# EAGLE design Laser_Teensy_proto_edits_11-21 (EAGLE 9.6.2)

## Sheet 1 of 3
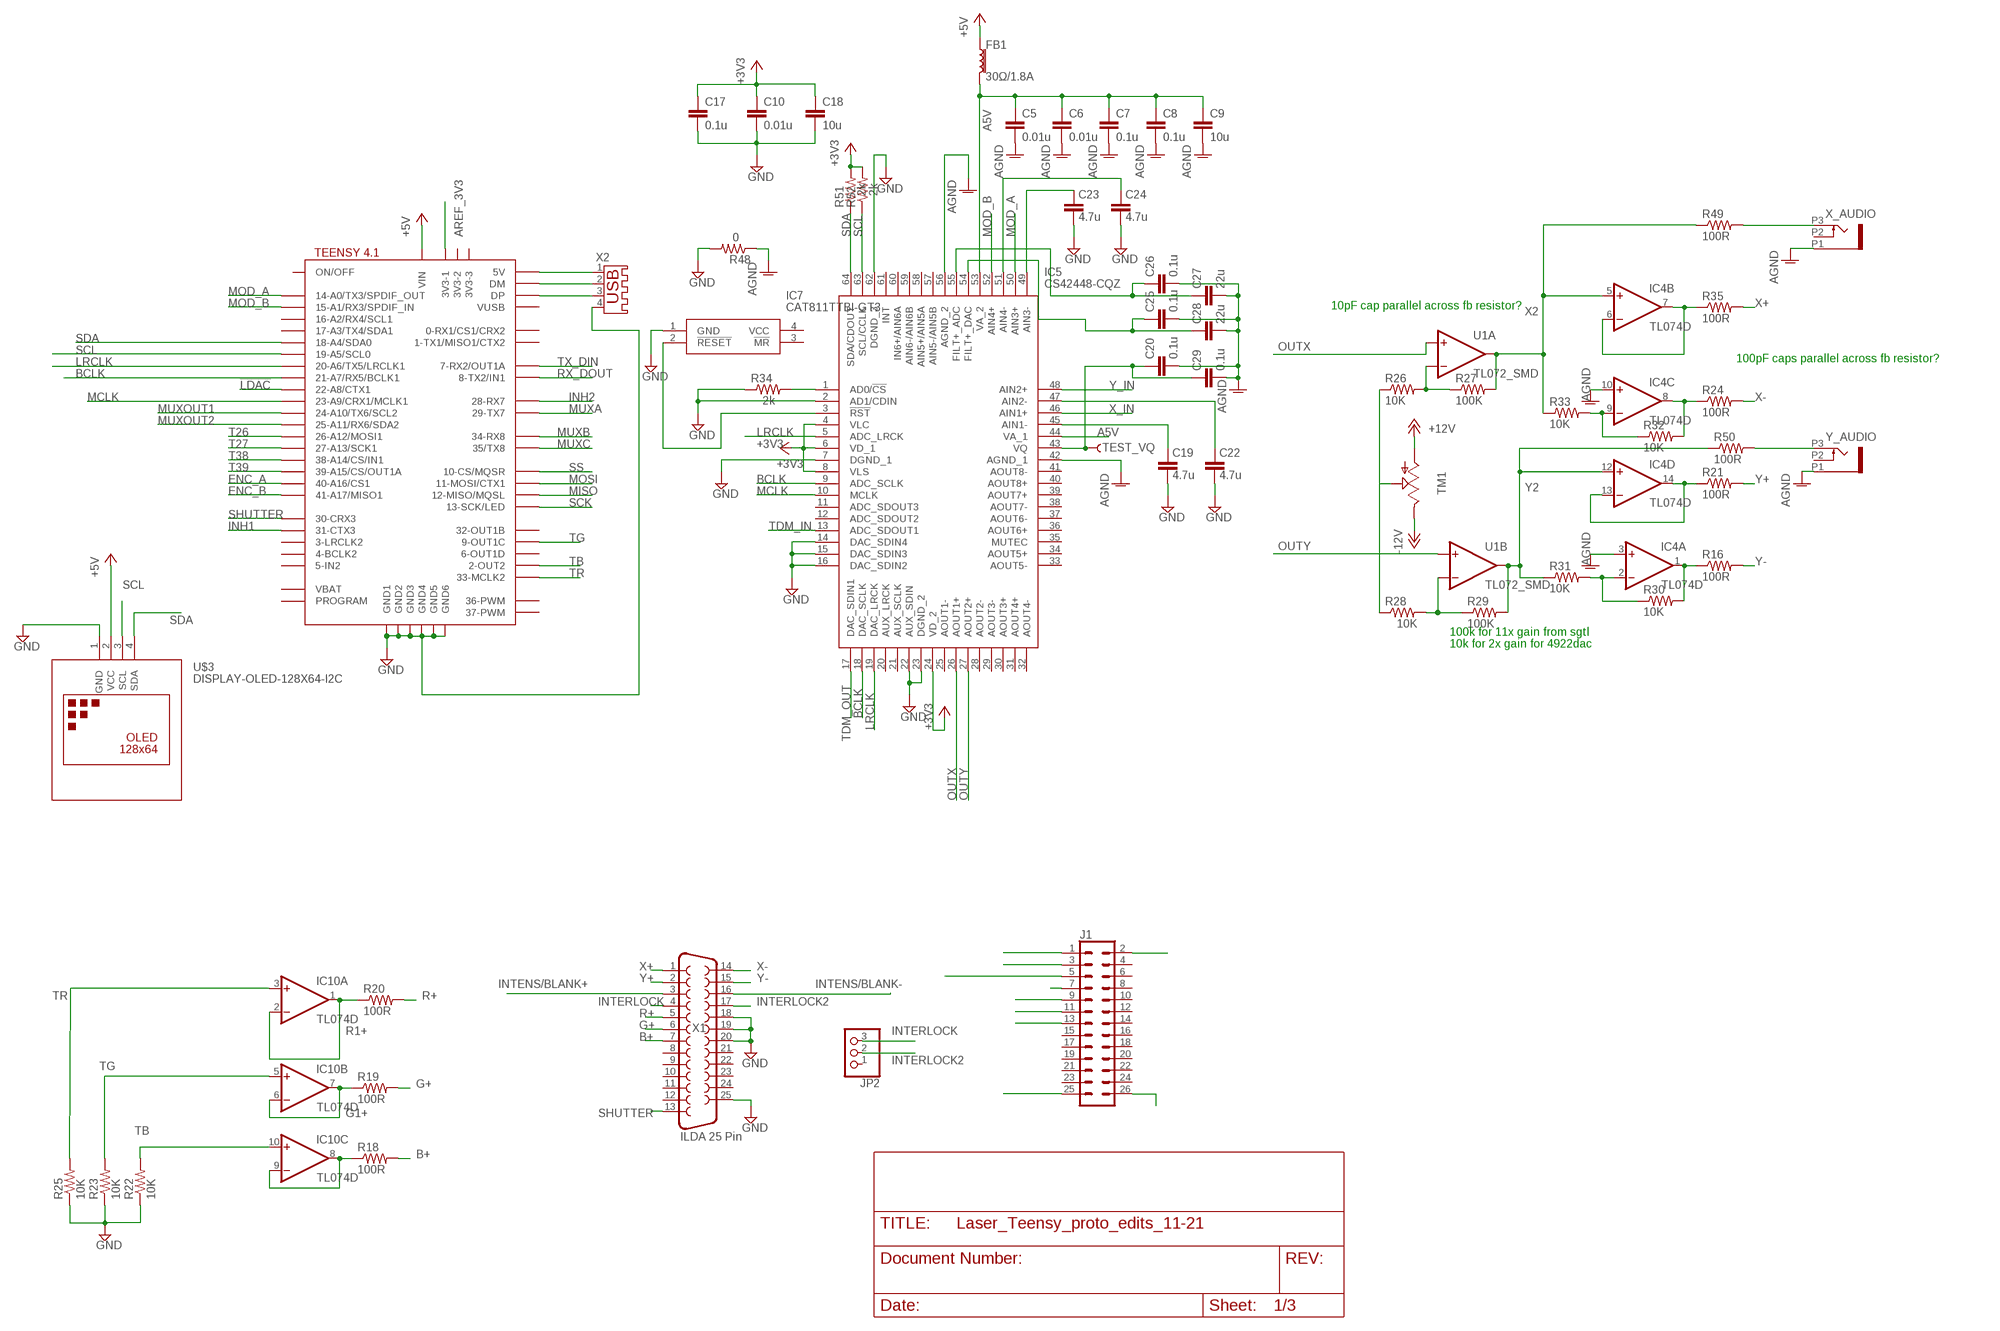
[diagram p0: schematic, sheet 1]

### Parts
C5  0.01u  C-EUC0603  [C0603]
C6  0.01u  C-EUC0603  [C0603]
C7  0.1u  C-EUC0603  [C0603]
C8  0.1u  C-EUC0603  [C0603]
C9  10u  C-EUC0603  [C0603]
C10  0.01u  C-EUC0603  [C0603]
C17  0.1u  C-EUC0603  [C0603]
C18  10u  C-EUC0603  [C0603]
C19  4.7u  C-EUC0603  [C0603]
C20  0.1u  C-EUC0603  [C0603]
C22  4.7u  C-EUC0603  [C0603]
C23  4.7u  C-EUC0603  [C0603]
C24  4.7u  C-EUC0603  [C0603]
C25  0.1u  C-EUC0603  [C0603]
C26  0.1u  C-EUC0603  [C0603]
C27  22u  C-EUC0603  [C0603]
C28  22u  C-EUC0603  [C0603]
C29  0.1u  C-EUC0603  [C0603]
FB1  30Ω/1.8A  FERRITE_BEAD-0603  [0603]
IC4  TL074D  [SO14]
IC5  CS42448-CQZ  [QFP50P1200X1200X160-64N]
IC7  CAT811TTBI-GT3  [4-PIN-SOT-143(BI-SUFFIX-CASE-5]
IC10  TL074D  [SO14]
J1  CONN_13X22X13  [2X13]
JP2  PINHD-1X3  [1X03]
R16  100R  R-US_R0603  [R0603]
R18  100R  R-US_R0603  [R0603]
R19  100R  R-US_R0603  [R0603]
R20  100R  R-US_R0603  [R0603]
R21  100R  R-US_R0603  [R0603]
R22  10K  R-US_R0603  [R0603]
R23  10K  R-US_R0603  [R0603]
R24  100R  R-US_R0603  [R0603]
R25  10K  R-US_R0603  [R0603]
R26  10K  R-US_R0603  [R0603]
R27  100K  R-US_R0603  [R0603]
R28  10K  R-US_R0603  [R0603]
R29  100K  R-US_R0603  [R0603]
R30  10K  R-US_R0603  [R0603]
R31  10K  R-US_R0603  [R0603]
R32  10K  R-US_R0603  [R0603]
R33  10K  R-US_R0603  [R0603]
R34  2k  R-US_R0603  [R0603]
R35  100R  R-US_R0603  [R0603]
R48  0  R-US_R0603  [R0603]
R49  100R  R-US_R0603  [R0603]
R50  100R  R-US_R0603  [R0603]
R51  2k  R-US_R0603  [R0603]
R52  2k  R-US_R0603  [R0603]
TEST_VQ  TEST-VQ  TEST-POINT3  [PAD.03X.03]
TM1  TRIM  [6MM]
U1  TL072_SMD  [SO08]
U$2  TEENSY41-E  [TENNSY41-E]
U$3  DISPLAY-OLED-128X64-I2C  [DISPLAY-OLED-128X64-I2C]
X1  ILDA 25 Pin  F25D  [F25D]
X2  USB-A003  [USB-A003]
X_AUDIO  PJ301_THONKICONN6  [WQP_PJ_301M6]
Y_AUDIO  PJ301_THONKICONN6  [WQP_PJ_301M6]

### Nets
!LDAC: U$2.22-A8/CTX1
+3V3: C10.1 C17.1 C18.1 IC5.4(VLC) IC5.6(VD_1) IC5.8(VLS) IC5.24(VD_2) R51.2 R52.2 ; also sheet 2,3
+5V [power]: FB1.1 U$2.VIN U$3.2(VCC) ; also sheet 2,3
+12V [power]: TM1.A ; also sheet 3
-12V [power]: TM1.E ; also sheet 3
A5V: C5.1 C6.1 C7.1 C8.1 C9.1 FB1.2 IC5.44(VA_1) IC5.53(VA_2)
AGND: C5.2 C6.2 C7.2 C8.2 C9.2 C20.2 C25.2 C26.2 C27.2 C28.2 C29.2 IC4.3(A:+IN) IC4.10(C:+IN) IC5.42(AGND_1) IC5.56(AGND_2) R48.1 X_AUDIO.P1 Y_AUDIO.P1 ; also sheet 2,3
AREF_3V3: U$2.3V3-1
B1+1: IC10.8(C:OUT) IC10.9(C:-IN) R18.1
B+: R18.2 X1.7
BCLK: IC5.9(ADC_SCLK) IC5.18(DAC_SCLK) U$2.21-A7/RX5/BCLK1
ENC_A: U$2.40-A16/CS1 ; also sheet 2
ENC_B: U$2.41-A17/MISO1 ; also sheet 2
G1+: IC10.6(B:-IN) IC10.7(B:OUT) R19.1
G+: R19.2 X1.6
GND: C10.2 C17.2 C18.2 C19.2 C22.2 C23.2 C24.2 IC5.2(AD1/CDIN) IC5.7(DGND_1) IC5.14(DAC_SDIN4) IC5.15(DAC_SDIN3) IC5.16(DAC_SDIN2) IC5.22(AUX_SDIN) IC5.23(DGND_2) IC5.62(DGND_3) IC7.1(GND) R22.1 R23.1 R25.1 R34.1 R48.2 U$2.GND1 U$2.GND2 U$2.GND3 U$2.GND4 U$2.GND5 U$2.GND6 U$3.1(GND) X1.18 X1.19 X1.20 X1.25 X2.4 ; also sheet 2,3
INH1: U$2.31-CTX3 ; also sheet 2
INH2: U$2.28-RX7 ; also sheet 2
INTENS/BLANK+: X1.3
INTENS/BLANK-: X1.16
INTERLOCK: JP2.3 X1.4
INTERLOCK2: JP2.2 X1.17
LRCLK: IC5.5(ADC_LRCK) IC5.19(DAC_LRCK) U$2.20-A6/TX5/LRCLK1
MCLK: IC5.10(MCLK) U$2.23-A9/CRX1/MCLK1
MISO: U$2.12-MISO/MQSL
MOD_A: IC5.50(AIN3+) U$2.14-A0/TX3/SPDIF_OUT ; also sheet 2
MOD_B: IC5.52(AIN4+) U$2.15-A1/RX3/SPDIF_IN ; also sheet 2
MOSI: U$2.11-MOSI/CTX1
MUXA: U$2.29-TX7 ; also sheet 2
MUXB: U$2.34-RX8 ; also sheet 2
MUXC: U$2.35-TX8(35/TX8) ; also sheet 2
MUXOUT1: U$2.24-A10/TX6/SCL2 ; also sheet 2
MUXOUT2: U$2.25-A11/RX6/SDA2 ; also sheet 2
N$1: IC5.3(!RST) IC7.2(!RESET)
N$2: R26.1 R28.1 TM1.S
N$3: U$2.+5V(5V) X2.1
N$4: U$2.DM X2.2
N$5: U$2.DP X2.3
N$12: J1.1
N$13: R49.2 X_AUDIO.P3
N$17: C23.1 IC5.49(AIN3-)
N$18: R50.2 Y_AUDIO.P3
N$30: R26.2 R27.1 U1.2(A:-IN)
N$31: R28.2 R29.1 U1.6(B:-IN)
N$35: IC4.9(C:-IN) R32.1 R33.2
N$36: IC4.2(A:-IN) R30.1 R31.2
N$37: C24.1 IC5.51(AIN4-)
N$38: C19.1 IC5.45(AIN1-)
N$47: C22.1 IC5.47(AIN2-)
N$50: IC5.1(AD0/!CS) R34.2
N$53: J1.3
N$54: J1.5
N$55: J1.7
N$56: J1.9
N$57: J1.11
N$58: J1.13
N$59: J1.25
N$60: J1.26
N$61: C26.1 C27.1 IC5.55(FILT+_ADC)
N$62: C25.1 C28.1 IC5.54(FILT+_DAC)
N$63: C20.1 C29.1 IC5.43(VQ) TEST_VQ.P$1
N$64: J1.2
OUTX: IC5.26(AOUT1+) U1.3(A:+IN)
OUTY: IC5.27(AOUT2+) U1.5(B:+IN)
R1+: IC10.1(A:OUT) IC10.2(A:-IN) R20.1
R+: R20.2 X1.5
RX_DOUT: U$2.8-TX2/IN1
SCK: U$2.13-SCK/LED
SCL: IC5.63(SCL/CCLK) R52.1 U$2.19-A5/SCL0 U$3.3(SCL)
SDA: IC5.64(SDA/CDOUT) R51.1 U$2.18-A4/SDA0 U$3.4(SDA)
SHUTTER: U$2.30-CRX3 X1.13
SS: U$2.10-CS\MQSR(10-CS/MQSR)
T26: U$2.26-A12/MOSI1 ; also sheet 2
T27: U$2.27-A13/SCK1 ; also sheet 2
T38: U$2.38-A14/CS/IN1 ; also sheet 2
T39: U$2.39-A15/CS/OUT1A
TB: IC10.10(C:+IN) R22.2 U$2.2-OUT2
TDM_IN: IC5.13(ADC_SDOUT1)
TDM_OUT: IC5.17(DAC_SDIN1)
TG: IC10.5(B:+IN) R23.2 U$2.9-OUT1C
TR: IC10.3(A:+IN) R25.2 U$2.33-MCLK2
TX_DIN: U$2.7-RX2/OUT1A
X1+: IC4.6(B:-IN) IC4.7(B:OUT) R35.1
X1-: IC4.8(C:OUT) R24.1 R32.2
X2: IC4.5(B:+IN) R27.2 R33.1 R49.1 U1.1(A:OUT)
X+: R35.2 X1.1
X-: R24.2 X1.14
X_IN: IC5.46(AIN1+) ; also sheet 2
Y1+: IC4.13(D:-IN) IC4.14(D:OUT) R21.1
Y1-: IC4.1(A:OUT) R16.1 R30.2
Y2: IC4.12(D:+IN) R29.2 R31.1 R50.1 U1.7(B:OUT)
Y+: R21.2 X1.2
Y-: R16.2 X1.15
Y_IN: IC5.48(AIN2+) ; also sheet 2
Unconnected: IC5.11(ADC_SDOUT3) IC5.12(ADC_SDOUT2) IC5.20(AUX_LRCK) IC5.21(AUX_SCLK) IC5.25(AOUT1-) IC5.28(AOUT2-) IC5.29(AOUT3-) IC5.30(AOUT3+) IC5.31(AOUT4+) IC5.32(AOUT4-) IC5.33(AOUT5-) IC5.34(AOUT5+) IC5.35(MUTEC) IC5.36(AOUT6+) IC5.37(AOUT6-) IC5.38(AOUT7-) IC5.39(AOUT7+) IC5.40(AOUT8+) IC5.41(AOUT8-) IC5.57(AIN5-/AIN5B) IC5.58(AIN5+/AIN5A) IC5.59(AIN6-/AIN6B) IC5.60(IN6+/AIN6A) IC5.61(INT) IC7.3(!MR) J1.4 J1.6 J1.8 J1.10 J1.12 J1.14 J1.15 J1.16 J1.17 J1.18 J1.19 J1.20 J1.21 J1.22 J1.23 J1.24 JP2.1 U$2.0-RX1/CS1/CRX2 U$2.1-TX1/MISO1/CTX2 U$2.3-LRCLK2 U$2.3V3-2 U$2.3V3-3 U$2.4-BCLK2 U$2.5-IN2 U$2.6-OUT1D U$2.16-A2/RX4/SCL1 U$2.17-A3/TX4/SDA1 U$2.32-OUT1B U$2.36-PWM U$2.37-PWM U$2.ON/OFF U$2.PROGRAM U$2.VBAT U$2.VUSB X1.8 X1.9 X1.10 X1.11 X1.12 X1.21 X1.22 X1.23 X1.24 X_AUDIO.P2 Y_AUDIO.P2

### Notes on the sheet
- 10pF cap parallel across fb resistor?
- 100pF caps parallel across fb resistor?
- 100k for 11x gain from sgtl
- 10k for 2x gain for 4922dac

## Sheet 2 of 3
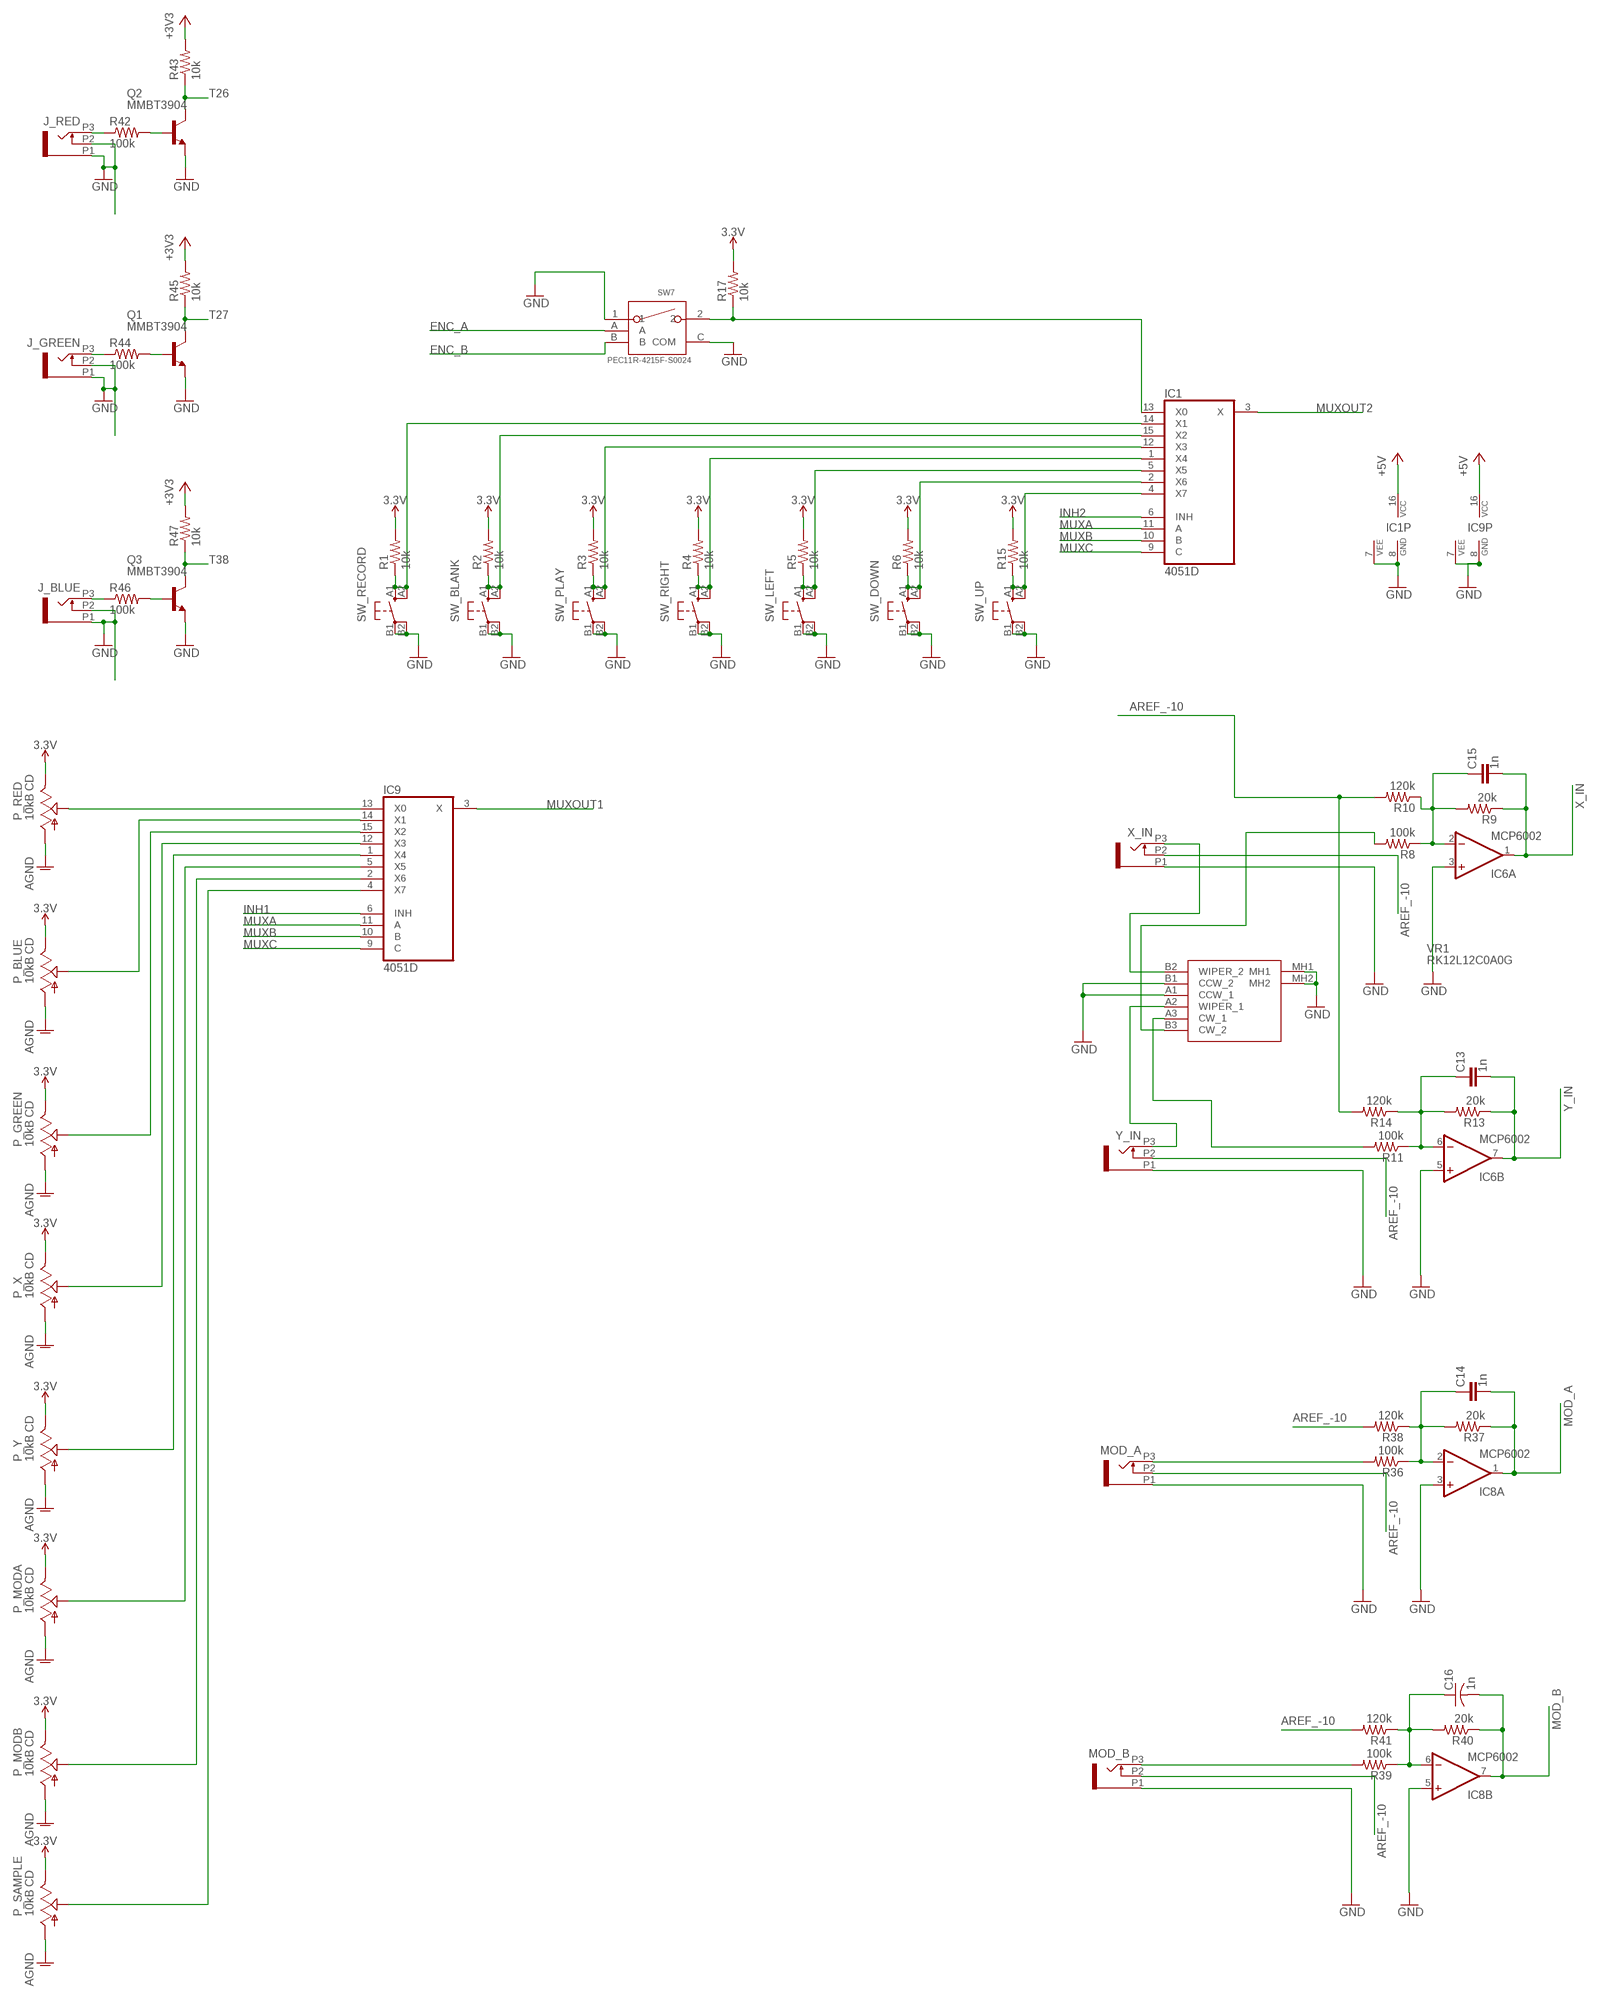
[diagram p1: schematic, sheet 2]

### Parts
C13  1n  C-EUC0603  [C0603]
C14  1n  C-EUC0603  [C0603]
C15  1n  C-EUC0603  [C0603]
C16  1n  C-USC0603K  [C0603K]
IC1  4051D  [SO16]
IC6  MCP6002  TL072D  [SO08]
IC8  MCP6002  TL072D  [SO08]
IC9  4051D  [SO16]
J_BLUE  PJ301_THONKICONN6  [WQP_PJ_301M6]
J_GREEN  PJ301_THONKICONN6  [WQP_PJ_301M6]
J_RED  PJ301_THONKICONN6  [WQP_PJ_301M6]
MOD_A  PJ301_THONKICONN6  [WQP_PJ_301M6]
MOD_B  PJ301_THONKICONN6  [WQP_PJ_301M6]
P_BLUE  10kB CD  POT_USVERTICAL_PS  [ALPS_POT_VERTICAL_PS]
P_GREEN  10kB CD  POT_USVERTICAL_PS  [ALPS_POT_VERTICAL_PS]
P_MODA  10kB CD  POT_USVERTICAL_PS  [ALPS_POT_VERTICAL_PS]
P_MODB  10kB CD  POT_USVERTICAL_PS  [ALPS_POT_VERTICAL_PS]
P_RED  10kB CD  POT_USVERTICAL_PS  [ALPS_POT_VERTICAL_PS]
P_SAMPLE  10kB CD  POT_USVERTICAL_PS  [ALPS_POT_VERTICAL_PS]
P_X  10kB CD  POT_USVERTICAL_PS  [ALPS_POT_VERTICAL_PS]
P_Y  10kB CD  POT_USVERTICAL_PS  [ALPS_POT_VERTICAL_PS]
Q1  MMBT3904  MMBT3904LT1-NPN-SOT23-BEC  [SOT23-BEC]
Q2  MMBT3904  MMBT3904LT1-NPN-SOT23-BEC  [SOT23-BEC]
Q3  MMBT3904  MMBT3904LT1-NPN-SOT23-BEC  [SOT23-BEC]
R1  10k  R-US_R0603  [R0603]
R2  10k  R-US_R0603  [R0603]
R3  10k  R-US_R0603  [R0603]
R4  10k  R-US_R0603  [R0603]
R5  10k  R-US_R0603  [R0603]
R6  10k  R-US_R0603  [R0603]
R8  100k  R-US_R0603  [R0603]
R9  20k  R-US_R0603  [R0603]
R10  120k  R-US_R0603  [R0603]
R11  100k  R-US_R0603  [R0603]
R13  20k  R-US_R0603  [R0603]
R14  120k  R-US_R0603  [R0603]
R15  10k  R-US_R0603  [R0603]
R17  10k  R-US_R0603  [R0603]
R36  100k  R-US_R0603  [R0603]
R37  20k  R-US_R0603  [R0603]
R38  120k  R-US_R0603  [R0603]
R39  100k  R-US_R0603  [R0603]
R40  20k  R-US_R0603  [R0603]
R41  120k  R-US_R0603  [R0603]
R42  100k  R-US_R0603  [R0603]
R43  10k  R-US_R0603  [R0603]
R44  100k  R-US_R0603  [R0603]
R45  10k  R-US_R0603  [R0603]
R46  100k  R-US_R0603  [R0603]
R47  10k  R-US_R0603  [R0603]
SW7  PEC11R-4215F-S0024  [PEC11R-4215F-S0024]
SW_BLANK  D6R  [D6R]
SW_DOWN  D6R  [D6R]
SW_LEFT  D6R  [D6R]
SW_PLAY  D6R  [D6R]
SW_RECORD  D6R  [D6R]
SW_RIGHT  D6R  [D6R]
SW_UP  D6R  [D6R]
VR1  RK12L12C0A0G  [RK12L12C0A0G]
X_IN  PJ301_THONKICONN6  [WQP_PJ_301M6]
Y_IN  PJ301_THONKICONN6  [WQP_PJ_301M6]

### Nets
3.3V [+3V3]: P_BLUE.P$1(E) P_GREEN.P$1(E) P_MODA.P$1(E) P_MODB.P$1(E) P_RED.P$1(E) P_SAMPLE.P$1(E) P_X.P$1(E) P_Y.P$1(E) R1.2 R2.2 R3.2 R4.2 R5.2 R6.2 R15.2 R17.2
+3V3: R43.2 R45.2 R47.2 ; also sheet 1,3
+5V [power]: IC1.16(VCC) IC9.16(VCC) ; also sheet 1,3
AGND: P_BLUE.P$3(A) P_GREEN.P$3(A) P_MODA.P$3(A) P_MODB.P$3(A) P_RED.P$3(A) P_SAMPLE.P$3(A) P_X.P$3(A) P_Y.P$3(A) ; also sheet 1,3
AREF_-10 [-10V]: MOD_A.P2 MOD_B.P2 R10.2 R14.2 R38.2 R41.2 X_IN.P2 Y_IN.P2 ; also sheet 3
ENC_A: SW7.A ; also sheet 1
ENC_B: SW7.B ; also sheet 1
GND: IC1.7(VEE) IC1.8(GND) IC6.3(A:+IN) IC6.5(B:+IN) IC8.3(A:+IN) IC8.5(B:+IN) IC9.7(VEE) IC9.8(GND) J_BLUE.P1 J_BLUE.P2 J_GREEN.P1 J_GREEN.P2 J_RED.P1 J_RED.P2 MOD_A.P1 MOD_B.P1 Q1.E Q2.E Q3.E SW7.1 SW7.C(COM) SW_BLANK.B1(P) SW_BLANK.B2(P1) SW_DOWN.B1(P) SW_DOWN.B2(P1) SW_LEFT.B1(P) SW_LEFT.B2(P1) SW_PLAY.B1(P) SW_PLAY.B2(P1) SW_RECORD.B1(P) SW_RECORD.B2(P1) SW_RIGHT.B1(P) SW_RIGHT.B2(P1) SW_UP.B1(P) SW_UP.B2(P1) VR1.A1(CCW_1) VR1.B1(CCW_2) VR1.MH1 VR1.MH2 X_IN.P1 Y_IN.P1 ; also sheet 1,3
INH1: IC9.6(INH) ; also sheet 1
INH2: IC1.6(INH) ; also sheet 1
MOD_A: C14.2 IC8.1(A:OUT) R37.1 ; also sheet 1
MOD_B: C16.2 IC8.7(B:OUT) R40.1 ; also sheet 1
MUXA: IC1.11(A) IC9.11(A) ; also sheet 1
MUXB: IC1.10(B) IC9.10(B) ; also sheet 1
MUXC: IC1.9(C) IC9.9(C) ; also sheet 1
MUXOUT1: IC9.3(X) ; also sheet 1
MUXOUT2: IC1.3(X) ; also sheet 1
N$6: C15.1 IC6.2(A:-IN) R8.1 R9.2 R10.1
N$9: VR1.B2(WIPER_2) X_IN.P3
N$11: C13.1 IC6.6(B:-IN) R11.1 R13.2 R14.1
N$14: C14.1 IC8.2(A:-IN) R36.1 R37.2 R38.1
N$15: R8.2 VR1.B3(CW_2)
N$19: IC1.14(X1) R1.1 SW_RECORD.A1(S) SW_RECORD.A2(S1)
N$20: IC1.15(X2) R2.1 SW_BLANK.A1(S) SW_BLANK.A2(S1)
N$21: IC1.12(X3) R3.1 SW_PLAY.A1(S) SW_PLAY.A2(S1)
N$22: IC9.13(X0) P_RED.P$2(S)
N$23: IC1.1(X4) R4.1 SW_RIGHT.A1(S) SW_RIGHT.A2(S1)
N$24: IC9.14(X1) P_BLUE.P$2(S)
N$25: VR1.A2(WIPER_1) Y_IN.P3
N$26: IC1.5(X5) R5.1 SW_LEFT.A1(S) SW_LEFT.A2(S1)
N$27: IC9.15(X2) P_GREEN.P$2(S)
N$28: IC1.2(X6) R6.1 SW_DOWN.A1(S) SW_DOWN.A2(S1)
N$29: IC9.12(X3) P_X.P$2(S)
N$32: IC9.1(X4) P_Y.P$2(S)
N$33: IC1.4(X7) R15.1 SW_UP.A1(S) SW_UP.A2(S1)
N$34: C16.1 IC8.6(B:-IN) R39.1 R40.2 R41.1
N$39: IC1.13(X0) R17.1 SW7.2
N$40: IC9.5(X5) P_MODA.P$2(S)
N$41: IC9.2(X6) P_MODB.P$2(S)
N$42: IC9.4(X7) P_SAMPLE.P$2(S)
N$43: R11.2 VR1.A3(CW_1)
N$44: J_RED.P3 R42.1
N$45: MOD_A.P3 R36.2
N$46: MOD_B.P3 R39.2
N$48: Q1.B R44.2
N$49: J_GREEN.P3 R44.1
N$51: Q3.B R46.2
N$52: J_BLUE.P3 R46.1
N$66: Q2.B R42.2
T26: Q2.C R43.1 ; also sheet 1
T27: Q1.C R45.1 ; also sheet 1
T38: Q3.C R47.1 ; also sheet 1
X_IN: C15.2 IC6.1(A:OUT) R9.1 ; also sheet 1
Y_IN: C13.2 IC6.7(B:OUT) R13.1 ; also sheet 1

## Sheet 3 of 3
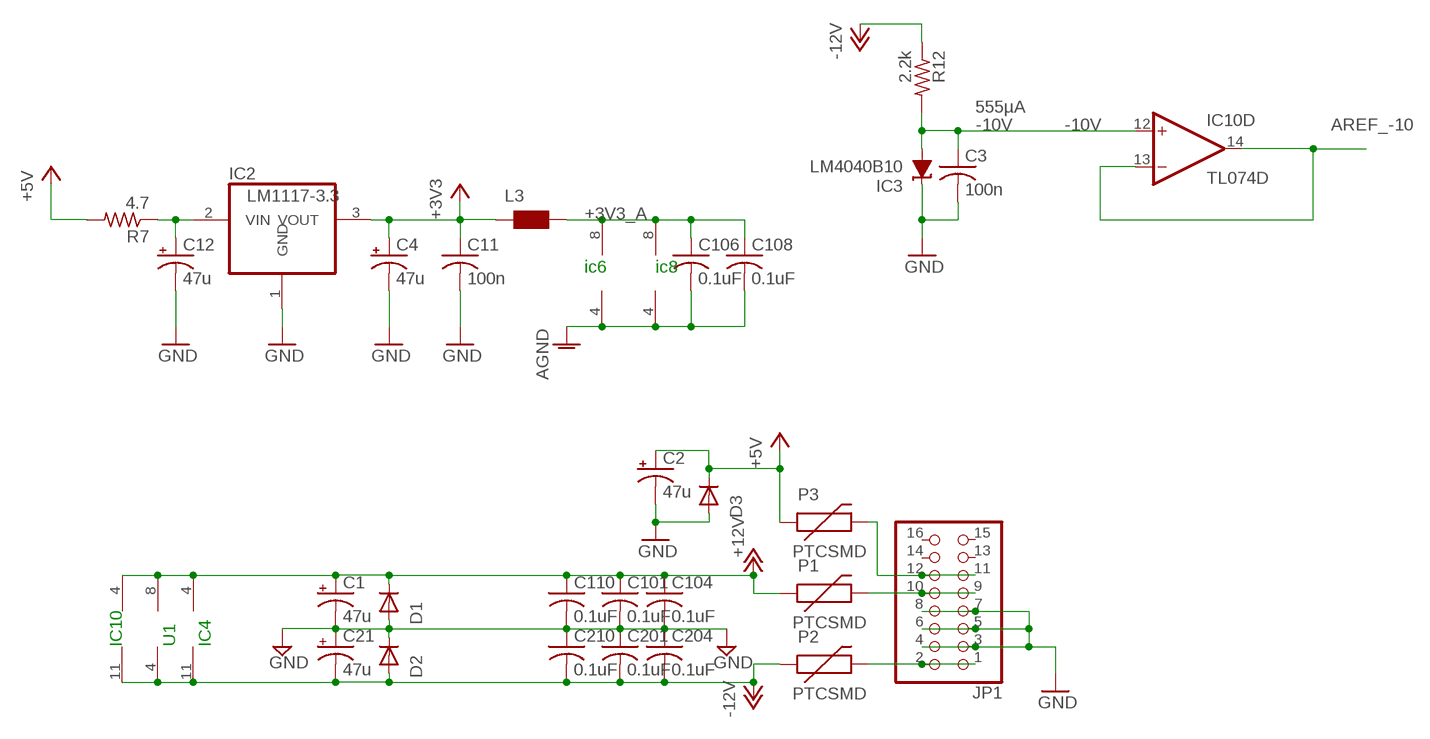
[diagram p2: schematic, sheet 3]

### Parts
C1  47u  CPOL-USE3.5-8  [E3,5-8]
C2  47u  CPOL-USE3.5-8  [E3,5-8]
C3  100n  C-USC0603  [C0603]
C4  47u  CPOL-USE3.5-8  [E3,5-8]
C11  100n  C-USC0603  [C0603]
C12  47u  CPOL-USE3.5-8  [E3,5-8]
C21  47u  CPOL-USE3.5-8  [E3,5-8]
C101  0.1uF  C-USC0603  [C0603]
C104  0.1uF  C-USC0603  [C0603]
C106  0.1uF  C-USC0603  [C0603]
C108  0.1uF  C-USC0603  [C0603]
C110  0.1uF  C-USC0603  [C0603]
C201  0.1uF  C-USC0603  [C0603]
C204  0.1uF  C-USC0603  [C0603]
C210  0.1uF  C-USC0603  [C0603]
D1  1N5819HW  DIODE-SOD123  [SOD123]
D2  1N5819HW  DIODE-SOD123  [SOD123]
D3  1N5819HW  DIODE-SOD123  [SOD123]
IC2  LM1117-3.3  REG1117T  [TO252]
IC3  LM4040B10  LM4041B12DBZ  [DBZ_R-PDSO-G3]
JP1  PINHD-2X8  [2X08]
L3  WE-CBF_0603  [0603]
P1  PTCSMD  [PTC-1206]
P2  PTCSMD  [PTC-1206]
P3  PTCSMD  [PTC-1206]
R7  4.7  R-US_R0603  [R0603]
R12  2.2k  R-US_R0603  [R0603]

### Nets
+3V3: C4.+ C11.1 IC2.3(VOUT) L3.1 ; also sheet 1,2
+3V3_A: C106.1 C108.1 IC6.8(P:V+) IC8.8(P:V+) L3.2
+5V [power]: C2.+ D3.C P3.1 R7.2 ; also sheet 1,2
+12V [power]: C1.+ C101.1 C104.1 C110.1 D1.C IC4.4(P:V+) IC10.4(P:V+) P1.1 U1.8(P:V+) ; also sheet 1
-10V [-10V]: C3.1 IC3.2(A) IC10.12(D:+IN) R12.2
-12V [power]: C21.- C201.2 C204.2 C210.2 D2.A IC4.11(P:V-) IC10.11(P:V-) P2.1 R12.1 U1.4(P:V-) ; also sheet 1
AGND: C106.2 C108.2 IC6.4(P:V-) IC8.4(P:V-) ; also sheet 1,2
AREF_-10 [-10V]: IC10.13(D:-IN) IC10.14(D:OUT) ; also sheet 2
GND: C1.- C2.- C3.2 C4.- C11.2 C12.- C21.+ C101.2 C104.2 C110.2 C201.1 C204.1 C210.1 D1.A D2.C D3.A IC2.1(GND) IC3.1(C) JP1.3 JP1.4 JP1.5 JP1.6 JP1.7 JP1.8 ; also sheet 1,2
N$7: JP1.1 JP1.2 P2.2
N$8: JP1.9 JP1.10 P1.2
N$10: JP1.11 JP1.12 P3.2
N$16: C12.+ IC2.2(VIN) R7.1
Unconnected: JP1.13 JP1.14 JP1.15 JP1.16

### Notes on the sheet
- 555µA
- ic6 | ic8
- IC10 | U1 | IC4

## Power pins joined to a net without a drawn wire
VCC: IC7.4(VCC)

## Library data of the parts
C1 C2 C4 C12 C21 = rcl:CPOL-US: POLARIZED CAPACITOR, American symbol; SPICEPREFIX: C
C3 C11 = rcl:C-US: CAPACITOR, American symbol
C5-C10 C13-C15 C17-C20 C22-C29 = rcl:C-EU: CAPACITOR, European symbol; SPICEPREFIX: C
C16 = rcl:C-US: CAPACITOR, American symbol; SPICEPREFIX: C
C101 C104 C106 C108 C110 C201 C204 C210 = adafruit:C-US: CAPACITOR, American symbol
D1-D3 = diode:DIODE-: DIODE
FB1 = SparkFun-Coils:FERRITE_BEAD: Ferrite Bead (blocks, cores, rings, chokes, etc.) Inductor with layers of ferrite used to suppress high frequencies. Often used to isolate high frequency noise. SparkFun Products: IOIO-OTG - V2.2 <https://www.sparkfun.com/products/13613> SparkFun SAMD21 Mini Breakout <https://www.sparkfun.com/products/13664> SparkFun 6 Degrees of Freedom Breakout - LSM6DS3 <https://www.sparkfun.com/products/13339> SparkFun SAMD21 Dev Breakout <https://www.sparkfun.com/products/13672>; PROD_ID: NDUC-07859
IC1 IC9 = 40xx:4051: 8-channel ANALOG MULTIPLEXER
IC2 = og-vreg:REG1117: 800mA and 1A Low Dropout (LDO) Positive Regulator 1.8V, 2.5V, 2.85V, 3.3V, 5V, and Adj
IC3 = texas:LM4041: PRECISION MICROPOWER SHUNT VOLTAGE REFERENCE Source: http://focus.ti.com/lit/ds/slcs146e/slcs146e.pdf
IC4 IC10 = linear:TL074: OP AMP
IC5 = SamacSys_Parts:CS42448-CQZ: Interface - CODECs 6-In 8-Out CODEC 108 dB 192 kHz Source: Datasheet <http://www.mouser.com/datasheet/2/76/CS42448_F5-1141475.pdf>; DESCRIPTION: Interface - CODECs 6-In 8-Out CODEC 108 dB 192 kHz; HEIGHT: 1.6mm; MANUFACTURER_NAME: Cirrus Logic; MANUFACTURER_PART_NUMBER: CS42448-CQZ; MOUSER_PART_NUMBER: 777-CS42448-CQZ; MOUSER_PRICE-STOCK: https://www.mouser.co.uk/ProductDetail/Cirrus-Logic/CS42448-CQZ?qs=bUPhaerQQeGUnfo%252BYCcmZw%3D%3D
IC6 IC8 = linear:TL072: OP AMP
IC7 = SamacSys_Parts:CAT811TTBI-GT3: uP PSU Supervisory IC Vth=3.075V SOT-143 ON Semiconductor CAT811TTBI-GT3, Voltage Supervisor 2.5V, 3V, 3.3V, 5V, Reset Input, 4-Pin SOT-143 Source: Datasheet <http://www.onsemi.com/pub/Collateral/CAT811-D.PDF>; ARROW_PART_NUMBER: CAT811TTBI-GT3; ARROW_PRICE-STOCK: https://www.arrow.com/en/products/cat811ttbi-gt3/on-semiconductor?region=nac; DESCRIPTION: uP PSU Supervisory IC Vth=3.075V SOT-143 ON Semiconductor CAT811TTBI-GT3, Voltage Supervisor 2.5V, 3V, 3.3V, 5V, Reset Input, 4-Pin SOT-143; HEIGHT: mm; MANUFACTURER_NAME: ON Semiconductor; MANUFACTURER_PART_NUMBER: CAT811TTBI-GT3; MOUSER_PART_NUMBER: 698-CAT811TTBI-GT3; MOUSER_PRICE-STOCK: https://www.mouser.co.uk/ProductDetail/onsemi/CAT811TTBI-GT3?qs=uDmhV2jwPRcoUWDTAizusg%3D%3D
J1 = SparkFun-Connectors:CONN_13X2: Multi connection point. Often used as Generic Header-pin footprint for 0.1 inch spaced/style header connections On any of the 0.1 inch spaced packages, you can populate with these: Break Away Headers - Straight <https://www.sparkfun.com/products/116> (PRT-00116) Break Away Male Headers - Right Angle <https://www.sparkfun.com/products/553> (PRT-00553) Female Headers <https://www.sparkfun.com/products/115> (PRT-00115) Break Away Headers - Machine Pin <https://www.sparkfun.com/products/117> (PRT-00117) Break Away Female Headers - Swiss Machine Pin <https://www.sparkfun.com/products/743> (PRT-00743)
J_BLUE J_GREEN J_RED = og-pj301:PJ301_THONKICONN
JP1 = pinhead:PINHD-2X8: PIN HEADER
JP2 = pinhead:PINHD-1X3: PIN HEADER
L3 = wuerth-elektronik:WE-CBF: SMD EMI Suppression Ferrite Beads - excellent anti-EMI properties - low DCR - impedances till 3000 ohms - rated current up to 6 A
MOD_A MOD_B X_AUDIO X_IN Y_AUDIO Y_IN = og-pj301_variations:PJ301_THONKICONN
P1-P3 = SparkFun:PTC: Resettable Fuse PTC Resettable Fuse. Spark Fun Electronics SKU : COM-08357
P_BLUE P_GREEN P_MODA P_MODB P_RED P_SAMPLE P_X P_Y = pot-alps:POT_US
Q1-Q3 = transistor:*-NPN-: NPN Transistror BF959 corrected 2008.03.06
R1-R6 R8-R31 R33-R52 = rcl:R-US_: RESISTOR, American symbol; SPICEPREFIX: R
R7 = rcl:R-US_: RESISTOR, American symbol
R32 = resistor:R-US_: RESISTOR, American symbol
SW7 = Switch:PEC11R-4215F-S0024: ROTARY ENCODER MECHANICAL 24PPR Manufacturer's datasheet <https://www.bourns.com/docs/Product-Datasheets/PEC11R.pdf>; CREATED_BY: PCBLayout.com; DIGIKEY_PART_NUMBER: PEC11R-4215F-S0024-ND; MANUFACTURER: Bourns Inc.; MPN: PEC11R-4215F-S0024
SW_BLANK SW_DOWN SW_LEFT SW_PLAY SW_RECORD SW_RIGHT SW_UP = og-switch:D6R: C&K D6R
TEST_VQ = SparkFun-Connectors:TEST-POINT: SparkFun Test Points Bare copper test points for troubleshooting or In-Circuit-Testing. These are used by our Production team for verifying production board runs using pogo-pins on test beds. SparkFun Products: SparkFun LSM9DS1 Breakout <https://www.sparkfun.com/products/13284> SparkFun PSOC <https://www.sparkfun.com/products/13714> SparkFun Load Cell Amplifier <https://www.sparkfun.com/products/13879>
TM1 = adafruit:TRIM
U1 = MusicThingModular:TL072: Generic Dual Op Amp
U$2 = teensy:TEENSY41-E
U$3 = diy-modules:DISPLAY-OLED-128X64-I2C: 128x64 Dot Matrix OLED Module based on SSD1306 chip Variant with I2C interface More details available here: http://www.instructables.com/id/Monochrome-096-i2c-OLED-display-with-arduino-SSD13/ SSD1306 datasheet: https://cdn-shop.adafruit.com/datasheets/SSD1306.pdf Click here to find device on ebay.com <http://www.ebay.com/sch/oled+display+128x64+iic> Note: There are two variants: I2C and SPI. Search for the proper version.
VR1 = SamacSys_Parts:RK12L12C0A0G: Alps Potentiometer RK12L Series with a 6 mm Dia. Shaft 10k +/-20%, Logarithmic, Through Hole Source: Datasheet <http://uk.rs-online.com/web/p/products/7293697P>; DESCRIPTION: Alps Potentiometer RK12L Series with a 6 mm Dia. Shaft 10k +/-20%, Logarithmic, Through Hole; HEIGHT: 15mm; MANUFACTURER_NAME: ALPS; MANUFACTURER_PART_NUMBER: RK12L12C0A0G; MOUSER_PART_NUMBER: 688-RK12L12C0A0G; MOUSER_PRICE-STOCK: https://www.mouser.co.uk/ProductDetail/ALPS/RK12L12C0A0G?qs=haWY0xvQGj%2FMhz6JhOHy%252BQ%3D%3D
X1 = SparkFun:F25: D-SUB 25 25 Pin male connector. PCB edge mount for regular PCB thicknesses. This connector will connect directly to the back of a PC parallel port or through a normal DB25 extension cable (M/F). SKU: PRT-08287
X2 = con-yamaichi:USB-A003: USB connector; OC_FARNELL: unknown; OC_NEWARK: unknown

## Net classes
1 power: width 0.305 mm, clearance 0.203 mm
2 +3V3: width 0.356 mm, clearance 0.152 mm to class 0, clearance 0.254 mm
3 -10V: width 0.356 mm, clearance 0.152 mm to class 0, clearance 0.254 mm
4 VCC: width 0.457 mm, clearance 0.152 mm to class 0, clearance 0.254 mm

## Board
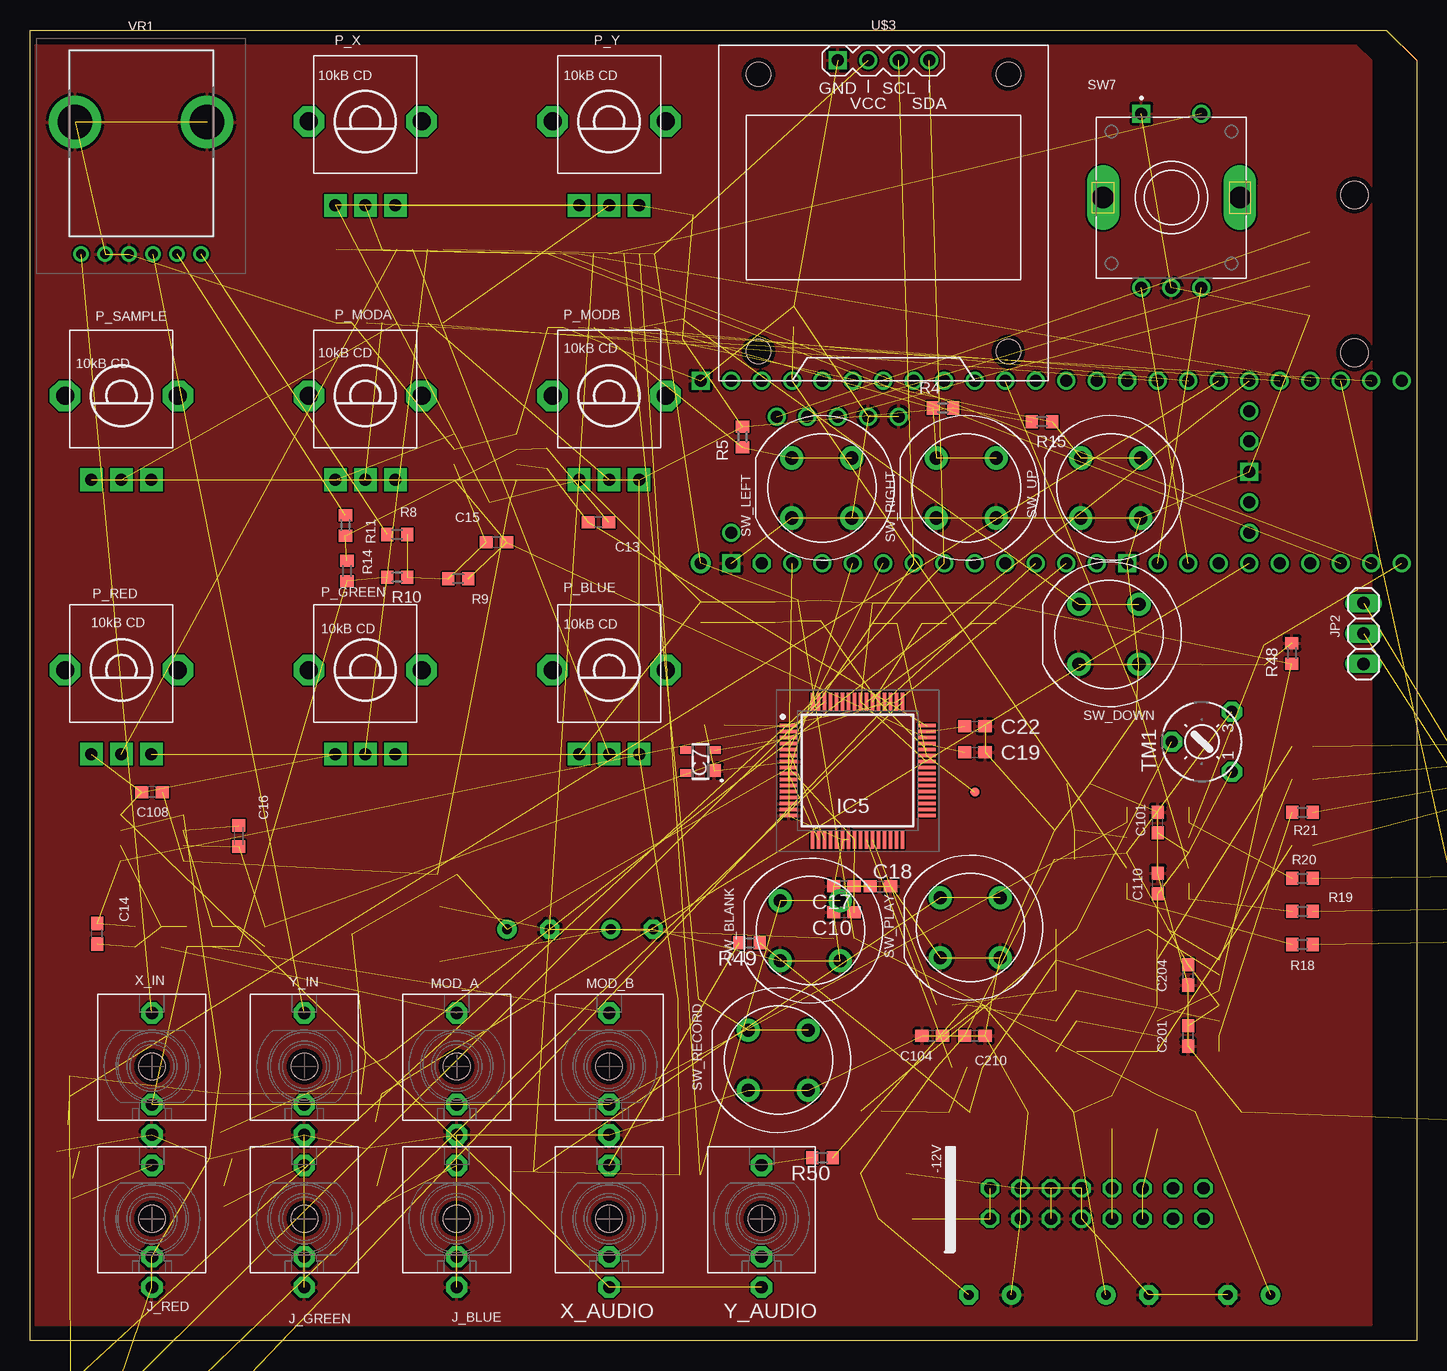
[diagram p3: board, top side]
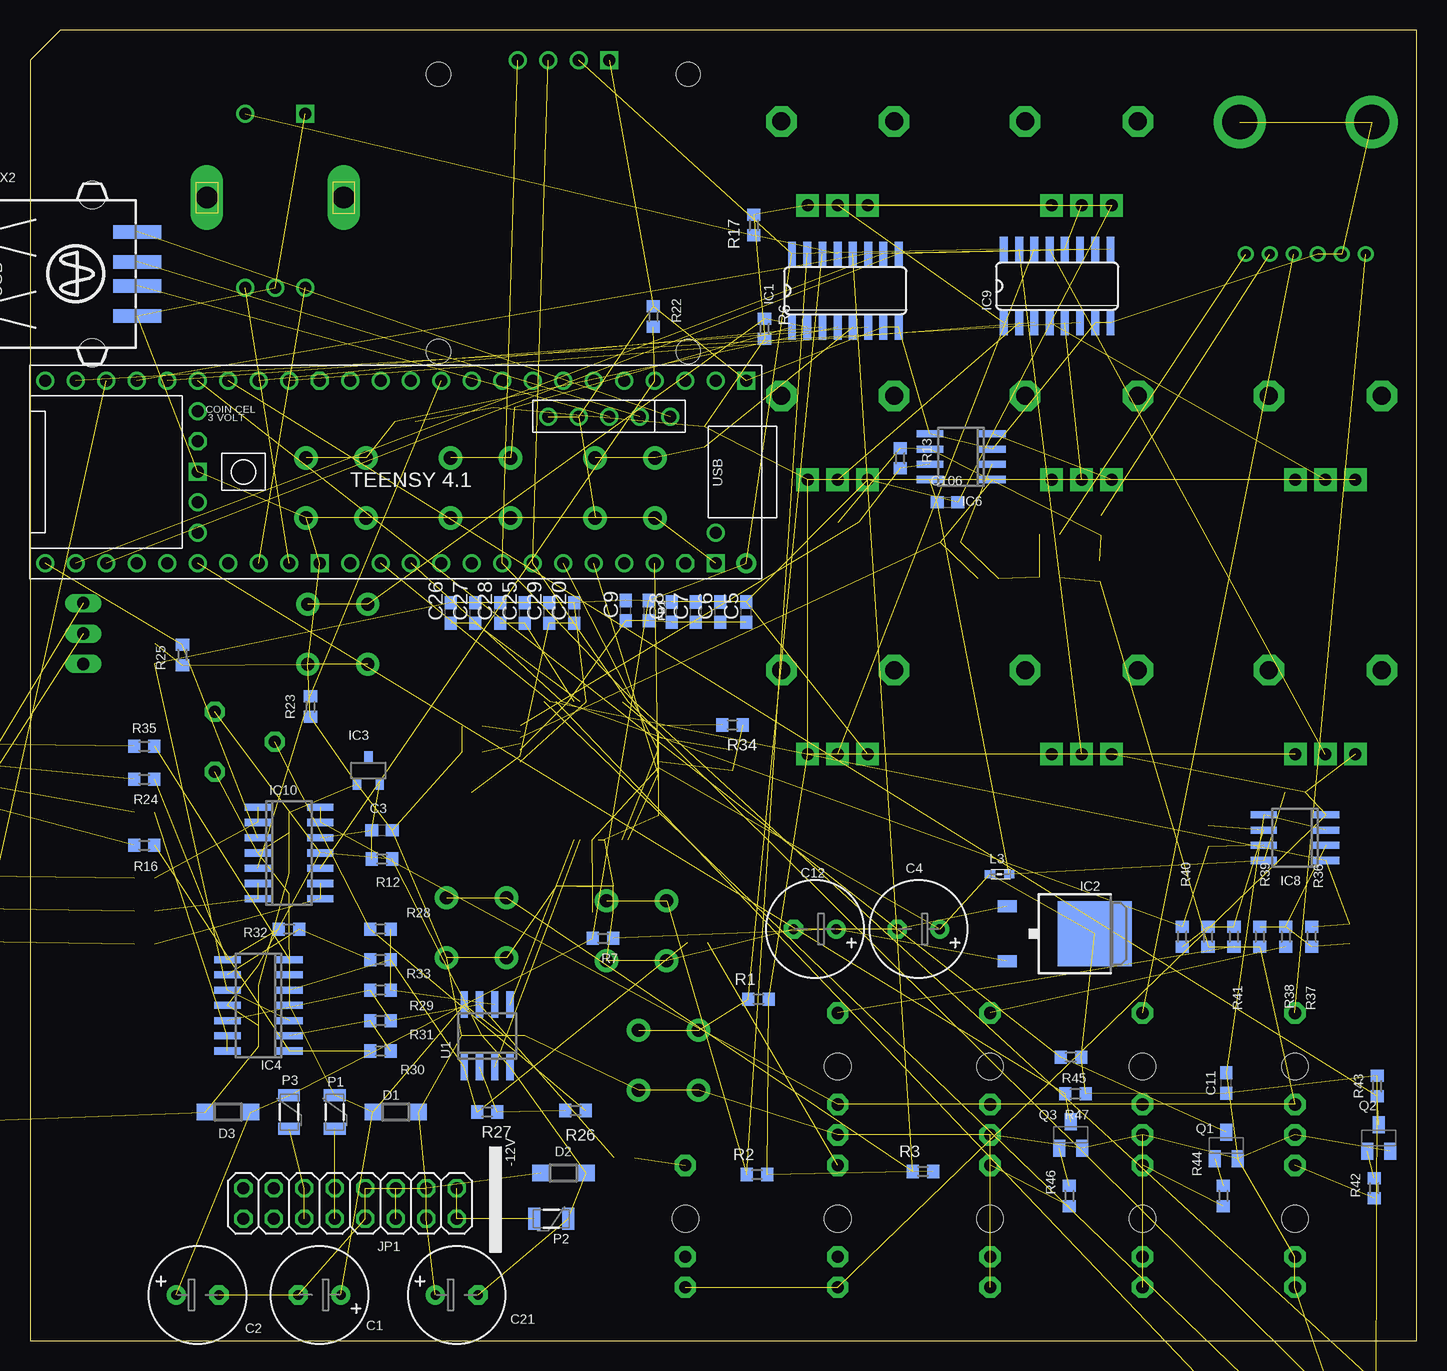
[diagram p4: board, bottom side, seen from below]

Size 115.57 x 109.22 mm. Coordinates in mm from the lower left corner, seen from the top.
Outline: 0,0 0,109.22 113.03,109.22 115.57,106.68 115.57,0 0,0
Copper layers (1*16): Top 0.0356mm / dielectric 1.5011mm / Bottom 0.0356mm
Design rules "LaenPCBOrder": minimum track width 6mil, minimum drill 13mil, track to track 6mil, track to pad 6mil, pad to pad 6mil, via to via 6mil, smd to smd 6mil, copper to edge 15mil, drill to drill 6mil, minimum pad ring 7mil, minimum via ring 7mil, stop-mask expansion 4mil, vias tented up to drill 0mil, thermal gap 10mil

### Footprints (pad centres in the part's own frame; a part is rotated, then mirrored left to right if it is on the bottom)
E3,5-8 = drill 0.813 pad 1.6: + -1.778,0 | drill 0.813 pad 1.6 octagon: - 1.778,0
C0603 = smd 1.1 x 1: 1 -0.85,0; 2 0.85,0
C0603K = smd 1.05 x 1.08: 1 -0.875,0; 2 0.875,0
SOD123 = smd 1.4 x 1.4: A 1.9,0; C -1.9,0
0603 = smd 1.1 x 1: 1 -0.85,0; 2 0.85,0
SO16 = smd 0.66 x 2.032: 1 -4.445,-3.073; 2 -3.175,-3.073; 3 -1.905,-3.073; 4 -0.635,-3.073; 5 0.635,-3.073; 6 1.905,-3.073; 7 3.175,-3.073; 8 4.445,-3.073; 9 4.445,3.073; 10 3.175,3.073; 11 1.905,3.073; 12 0.635,3.073; 13 -0.635,3.073; 14 -1.905,3.073; 15 -3.175,3.073; 16 -4.445,3.073
TO252 = smd 1 x 1.6: 1 -2.28,-4.8; 2 2.28,-4.8 | smd 5.4 x 6.2: 3 0,2.5
DBZ_R-PDSO-G3 = smd 0.7 x 1: 1 -0.95,-1.1; 2 0.95,-1.1; 3 0,1.1
SO14 = smd 0.6 x 2.2: 1 -3.81,-2.6; 2 -2.54,-2.6; 3 -1.27,-2.6; 4 0,-2.6; 5 1.27,-2.6; 6 2.54,-2.6; 7 3.81,-2.6; 8 3.81,2.6; 9 2.54,2.6; 10 1.27,2.6; 11 0,2.6; 12 -1.27,2.6; 13 -2.54,2.6; 14 -3.81,2.6
QFP50P1200X1200X160-64N = smd 1.5 x 0.3: 1 -5.75,3.75; 2 -5.75,3.25; 3 -5.75,2.75; 4 -5.75,2.25; 5 -5.75,1.75; 6 -5.75,1.25; 7 -5.75,0.75; 8 -5.75,0.25; 9 -5.75,-0.25; 10 -5.75,-0.75; 11 -5.75,-1.25; 12 -5.75,-1.75; 13 -5.75,-2.25; 14 -5.75,-2.75; 15 -5.75,-3.25; 16 -5.75,-3.75; 33 5.75,-3.75; 34 5.75,-3.25; 35 5.75,-2.75; 36 5.75,-2.25; 37 5.75,-1.75; 38 5.75,-1.25; 39 5.75,-0.75; 40 5.75,-0.25; 41 5.75,0.25; 42 5.75,0.75; 43 5.75,1.25; 44 5.75,1.75; 45 5.75,2.25; 46 5.75,2.75; 47 5.75,3.25; 48 5.75,3.75 | smd 0.3 x 1.5: 17 -3.75,-5.75; 18 -3.25,-5.75; 19 -2.75,-5.75; 20 -2.25,-5.75; 21 -1.75,-5.75; 22 -1.25,-5.75; 23 -0.75,-5.75; 24 -0.25,-5.75; 25 0.25,-5.75; 26 0.75,-5.75; 27 1.25,-5.75; 28 1.75,-5.75; 29 2.25,-5.75; 30 2.75,-5.75; 31 3.25,-5.75; 32 3.75,-5.75; 49 3.75,5.75; 50 3.25,5.75; 51 2.75,5.75; 52 2.25,5.75; 53 1.75,5.75; 54 1.25,5.75; 55 0.75,5.75; 56 0.25,5.75; 57 -0.25,5.75; 58 -0.75,5.75; 59 -1.25,5.75; 60 -1.75,5.75; 61 -2.25,5.75; 62 -2.75,5.75; 63 -3.25,5.75; 64 -3.75,5.75
SO08 = smd 0.6 x 2.2: 1 -1.905,-2.6; 2 -0.635,-2.6; 3 0.635,-2.6; 4 1.905,-2.6; 5 1.905,2.6; 6 0.635,2.6; 7 -0.635,2.6; 8 -1.905,2.6
4-PIN-SOT-143(BI-SUFFIX-CASE-5 = smd 1.05 x 1.1: 1 -0.76,-1.15 | smd 0.6 x 1.1: 2 0.96,-1.15; 3 0.96,1.15; 4 -0.96,1.15
2X13 = drill 1.016 pad 1.88: 1 0,0; 2 0,2.54; 3 2.54,0; 4 2.54,2.54; 5 5.08,0; 6 5.08,2.54; 7 7.62,0; 8 7.62,2.54; 9 10.16,0; 10 10.16,2.54; 11 12.7,0; 12 12.7,2.54; 13 15.24,0; 14 15.24,2.54; 15 17.78,0; 16 17.78,2.54; 17 20.32,0; 18 20.32,2.54; 19 22.86,0; 20 22.86,2.54; 21 25.4,0; 22 25.4,2.54; 23 27.94,0; 24 27.94,2.54; 25 30.48,0; 26 30.48,2.54
WQP_PJ_301M6 = drill 1.016 pad 1.778 octagon: P1 0,-5.715; P2 0,-3.175; P3 0,4.445 | hole 2.2: 0,0
2X08 = drill 1.016 octagon: 1 -8.89,-1.27; 2 -8.89,1.27; 3 -6.35,-1.27; 4 -6.35,1.27; 5 -3.81,-1.27; 6 -3.81,1.27; 7 -1.27,-1.27; 8 -1.27,1.27; 9 1.27,-1.27; 10 1.27,1.27; 11 3.81,-1.27; 12 3.81,1.27; 13 6.35,-1.27; 14 6.35,1.27; 15 8.89,-1.27; 16 8.89,1.27
1X03 = drill 1.016 long: 1 -2.54,0; 2 0,0; 3 2.54,0
0603' = smd 0.85 x 0.7: 1 -0.9,0; 2 0.7,0
PTC-1206 = smd 1 x 1.8: 1 -1.4,0; 2 1.4,0
ALPS_POT_VERTICAL_PS = drill 1 pad 1.88 square: P$1 -2.5,7; P$2 0,7; P$3 2.5,7 | drill 1.5 pad 2.54 octagon: P$4 -4.7,0; P$5 4.7,0
SOT23-BEC = smd 1 x 1.4: B -0.95,-1.1; C 0,1.1; E 0.95,-1.1
R0603 = smd 1 x 1.1: 1 -0.85,0; 2 0.85,0
PEC11R-4215F-S0024 = drill 1 square: 1 -2.5,7 | drill 1: 2 2.5,7; A -2.5,-7.5; B 2.5,-7.5; C 0,-7.5 | drill 1.8 long: P1 -5.7,0; P2 5.7,0
D6R = drill 1.1 pad 1.93: A1 -2.5,2.5; A2 2.5,2.5; B1 -2.5,-2.5; B2 2.5,-2.5
PAD.03X.03 = smd 0.762 x 0.762: P$1 0,0
6MM = drill 1 pad 1.676 octagon: A -2.5,-2.5; E 2.5,-2.5; S 0,2.5
TENNSY41-E = drill 1: 0-RX1/CS1/CRX2 -27.94,-7.62; 1-TX1/MISO1/CTX2 -25.4,-7.62; 2-OUT2 -22.86,-7.62; 3-LRCLK2 -20.32,-7.62; 4-BCLK2 -17.78,-7.62; 5-IN2 -15.24,-7.62; 6-OUT1D -12.7,-7.62; 7-RX2/OUT1A -10.16,-7.62; 8-TX2/IN1 -7.62,-7.62; 9-OUT1C -5.08,-7.62; 10-CS\MQSR -2.54,-7.62; 11-MOSI/CTX1 0,-7.62; 12-MISO/MQSL 2.54,-7.62; 13-SCK/LED 2.54,7.62; 14-A0/TX3/SPDIF_OUT 0,7.62; 15-A1/RX3/SPDIF_IN -2.54,7.62; 16-A2/RX4/SCL1 -5.08,7.62; 17-A3/TX4/SDA1 -7.62,7.62; 18-A4/SDA0 -10.16,7.62; 19-A5/SCL0 -12.7,7.62; 20-A6/TX5/LRCLK1 -15.24,7.62; 21-A7/RX5/BCLK1 -17.78,7.62; 22-A8/CTX1 -20.32,7.62; 23-A9/CRX1/MCLK1 -22.86,7.62; 24-A10/TX6/SCL2 7.62,-7.62; 25-A11/RX6/SDA2 10.16,-7.62; 26-A12/MOSI1 12.7,-7.62; 27-A13/SCK1 15.24,-7.62; 28-RX7 17.78,-7.62; 29-TX7 20.32,-7.62; 30-CRX3 22.86,-7.62; 31-CTX3 25.4,-7.62; 32-OUT1B 27.94,-7.62; 33-MCLK2 27.94,7.62; 34-RX8 25.4,7.62; 35-TX8 22.86,7.62; 36-PWM 20.32,7.62; 37-PWM 17.78,7.62; 38-A14/CS/IN1 15.24,7.62; 39-A15/CS/OUT1A 12.7,7.62; 40-A16/CS1 10.16,7.62; 41-A17/MISO1 7.62,7.62; +5V -24.13,-4.62; DM -21.59,-4.62; DP -19.05,-4.62; GND4 -16.51,-4.62; GND5 -13.97,-4.62; ON/OFF 15.24,5.08; PROGRAM 15.24,2.54; VBAT 15.24,-5.08; VUSB -27.94,5.08 | drill 1 octagon: 3V3-1 5.08,-7.62; 3V3-2 15.24,-2.54; 3V3-3 -25.4,7.62 | drill 1 square: GND1 -30.48,-7.62; GND2 15.24,0; GND3 5.08,7.62; GND6 -27.94,7.62 | drill 1 pad 1.676: VIN -30.48,7.62
DISPLAY-OLED-128X64-I2C = drill 1 square: 1 -3.81,12.7 | drill 1: 2 -1.27,12.7; 3 1.27,12.7; 4 3.81,12.7 | hole 2: -10.414,11.557; 10.414,11.557; 10.414,-11.557; -10.414,-11.557
RK12L12C0A0G = drill 0.8 pad 1.3: A1 0,0; A2 2,0; A3 4,0; B1 -2,0; B2 -4,0; B3 6,0 | drill 2.9 pad 4.35: MH1 -4.5,11; MH2 6.5,11
F25D = smd 1.7 x 3.5: 1 -16.459,-6.045; 2 -13.716,-6.045; 3 -10.973,-6.045; 4 -8.23,-6.045; 5 -5.486,-6.045; 6 -2.743,-6.045; 7 0,-6.045; 8 2.743,-6.045; 9 5.486,-6.045; 10 8.23,-6.045; 11 10.973,-6.045; 12 13.716,-6.045; 13 16.459,-6.045 | smd 1.7 x 3.5 bottom: 14 -15.088,-6.045; 15 -12.344,-6.045; 16 -9.601,-6.045; 17 -6.858,-6.045; 18 -4.115,-6.045; 19 -1.372,-6.045; 20 1.372,-6.045; 21 4.115,-6.045; 22 6.858,-6.045; 23 9.601,-6.045; 24 12.344,-6.045; 25 15.088,-6.045
USB-A003 = smd 1.12 x 4: 1 -3.5,14; 2 -1,14; 3 1,14; 4 3.5,14 | hole 2.3: -6.57,10.28; 6.57,10.28

### Placement (x,y rotation side)
C1  91.44,3.81 180 bottom
C2  101.6,3.81 0 bottom
C3  86.23,42.55 0 bottom
C4  41.53,34.29 180 bottom
C5  55.88,60.71 90 bottom
C6  58.04,60.71 90 bottom
C7  60.07,60.71 90 bottom
C8  62.1,60.71 90 bottom
C9  65.91,60.83 90 bottom
C10  67.82,35.69 180 top
C11  15.87,21.46 90 bottom
C12  50.16,34.29 180 bottom
C13  47.37,68.2 180 top
C14  5.59,33.91 90 top
C15  38.86,66.55 0 top
C16  17.4,42.04 270 top
C17  67.82,37.85 180 top
C18  70.87,37.85 0 top
C19  78.74,49.02 0 top
C20  70.23,60.64 90 bottom
C21  80.01,3.81 0 bottom
C22  78.74,51.18 0 top
C23  2.54,-15.24 0 top  (outside the outline)
C24  2.54,-20.32 0 top  (outside the outline)
C25  74.35,60.64 90 bottom
C26  80.52,60.64 90 bottom
C27  78.46,60.64 90 bottom
C28  76.4,60.64 90 bottom
C29  72.29,60.64 90 bottom
C101  93.98,43.18 90 top
C104  75.18,25.4 180 top
C106  39.12,69.85 0 bottom
C108  10.16,45.72 180 top
C110  93.98,38.1 90 top
C201  96.52,25.4 90 top
C204  96.52,30.48 90 top
C210  78.74,25.4 180 top
D1  85.09,19.05 0 bottom
D2  71.12,13.97 0 bottom
D3  99.06,19.05 180 bottom
FB1  64.01,60.83 270 bottom
IC1  47.62,87.5 0 bottom
IC2  29.34,33.91 270 bottom
IC3  87.38,47.5 0 bottom
IC4  96.52,27.94 90 bottom
IC5  68.96,47.5 0 top
IC6  37.97,73.66 90 bottom
IC7  55.88,48.26 90 top
IC8  10.16,41.91 90 bottom
IC9  29.97,87.88 0 bottom
IC10  93.98,40.64 270 bottom
J1  2.54,-27.94 0 top  (outside the outline)
J_BLUE  35.56,10.16 0 top
J_GREEN  22.86,10.16 0 top
J_RED  10.16,10.16 0 top
JP1  88.9,11.43 180 bottom
JP2  111.12,58.93 90 top
L3  [0603']  34.67,38.86 0 bottom
MOD_A  35.56,22.86 0 top
MOD_B  48.26,22.86 0 top
P1  90.17,19.05 270 bottom
P2  72.14,10.16 180 bottom
P3  93.98,19.05 270 bottom
P_BLUE  48.26,55.88 180 top
P_GREEN  27.94,55.88 180 top
P_MODA  27.94,78.74 180 top
P_MODB  48.26,78.74 180 top
P_RED  7.62,55.88 180 top
P_SAMPLE  7.62,78.74 180 top
P_X  27.94,101.6 180 top
P_Y  48.26,101.6 180 top
Q1  15.87,16.26 0 bottom
Q2  3.17,16.89 0 bottom
Q3  28.83,17.14 0 bottom
R1  54.86,28.45 0 bottom
R2  54.99,13.84 0 bottom
R3  41.15,14.1 0 bottom
R4  76.07,77.72 0 top
R5  59.37,75.31 90 top
R6  54.36,84.33 270 bottom
R7  67.82,33.53 180 bottom
R8  30.61,67.18 180 top
R9  35.69,63.5 180 top
R10  30.61,63.63 180 top
R11  26.29,67.94 90 top
R12  86.23,40.13 180 bottom
R13  43.05,73.53 90 bottom
R14  26.42,64.14 270 top
R15  84.33,76.58 180 top
R16  106.05,41.27 180 bottom
R17  55.24,92.96 90 bottom
R18  106.05,33.02 0 top
R19  106.05,35.77 0 top
R20  106.05,38.52 0 top
R21  106.05,44.03 0 top
R22  63.63,85.34 270 bottom
R23  92.2,52.83 90 bottom
R24  106.05,46.78 180 bottom
R25  102.87,57.15 90 bottom
R26  70.1,19.18 180 bottom
R27  77.47,19.05 180 bottom
R28  86.36,34.29 0 bottom
R29  86.36,29.21 180 bottom
R30  86.36,24.13 180 bottom
R31  86.36,26.67 180 bottom
R32  93.98,34.29 180 bottom
R33  86.36,31.75 180 bottom
R34  57.02,51.31 180 bottom
R35  106.05,49.53 180 bottom
R36  10.92,33.66 270 bottom
R37  8.76,33.66 270 bottom
R38  13.08,33.66 270 bottom
R39  15.24,33.66 270 bottom
R40  19.56,33.66 270 bottom
R41  17.4,33.66 270 bottom
R42  3.56,12.7 90 bottom
R43  3.3,21.21 90 bottom
R44  16.13,12.06 90 bottom
R45  28.83,23.62 0 bottom
R46  28.96,12.06 90 bottom
R47  28.45,20.57 0 bottom
R48  105.16,57.28 90 top
R49  59.94,33.15 180 top
R50  66.04,15.24 180 top
R51  2.54,-5.08 0 top  (outside the outline)
R52  2.54,-10.16 0 top  (outside the outline)
SW7  95.12,95.25 0 top
SW_BLANK  65.02,34.16 0 top
SW_DOWN  89.92,58.86 0 top
SW_LEFT  65.98,71.06 0 top
SW_PLAY  78.36,34.42 0 top
SW_RECORD  62.36,23.37 0 top
SW_RIGHT  78.02,71.06 0 top
SW_UP  90.07,71.06 0 top
TEST_VQ  78.74,45.72 0 top
TM1  97.66,49.91 90 top
U1  77.47,25.4 0 bottom
U$2  86.36,72.39 180 bottom
U$3  71.12,93.98 0 top
VR1  8.26,90.55 0 top
X1  129.29,33.27 270 top  (outside the outline)
X2  120.65,88.9 270 bottom
X_AUDIO  48.26,10.16 0 top
X_IN  10.16,22.86 0 top
Y_AUDIO  60.96,10.16 0 top
Y_IN  22.86,22.86 0 top

### Tracks (layer width: path | path; a pad name or v marks a point on that pad's centre or on a via)
3.3V  (15 unrouted)
+3V3  (15 unrouted)
+3V3_A  (4 unrouted)
+5V  (8 unrouted)
+12V  (9 unrouted)
-10V  (3 unrouted)
-12V  (10 unrouted)
A5V  (7 unrouted)
AGND  (29 unrouted)
AREF_-10  (9 unrouted)
B1+1  (2 unrouted)
B+  (1 unrouted)
BCLK  (2 unrouted)
ENC_A  (1 unrouted)
ENC_B  (1 unrouted)
G1+  (2 unrouted)
G+  (1 unrouted)
GND  (97 unrouted)
  pour Top: 0,107.95 110.49,107.95 111.76,106.68 111.76,1.27 0,1.27
INH1  (1 unrouted)
INH2  (1 unrouted)
INTERLOCK  (1 unrouted)
INTERLOCK2  (1 unrouted)
LRCLK  (2 unrouted)
MCLK  (1 unrouted)
MOD_A  (4 unrouted)
MOD_B  (4 unrouted)
MUXA  (2 unrouted)
MUXB  (2 unrouted)
MUXC  (2 unrouted)
MUXOUT1  (1 unrouted)
MUXOUT2  (1 unrouted)
N$1  (1 unrouted)
N$2  (2 unrouted)
N$3  (1 unrouted)
N$4  (1 unrouted)
N$5  (1 unrouted)
N$6  (4 unrouted)
N$7  (2 unrouted)
N$8  (2 unrouted)
N$9  (1 unrouted)
N$10  (2 unrouted)
N$11  (4 unrouted)
N$13  (1 unrouted)
N$14  (4 unrouted)
N$15  (1 unrouted)
N$16  (2 unrouted)
N$17  (1 unrouted)
N$18  (1 unrouted)
N$19  (3 unrouted)
N$20  (3 unrouted)
N$21  (3 unrouted)
N$22  (1 unrouted)
N$23  (3 unrouted)
N$24  (1 unrouted)
N$25  (1 unrouted)
N$26  (3 unrouted)
N$27  (1 unrouted)
N$28  (3 unrouted)
N$29  (1 unrouted)
N$30  (2 unrouted)
N$31  (2 unrouted)
N$32  (1 unrouted)
N$33  (3 unrouted)
N$34  (4 unrouted)
N$35  (2 unrouted)
N$36  (2 unrouted)
N$37  (1 unrouted)
N$38  (1 unrouted)
N$39  (2 unrouted)
N$40  (1 unrouted)
N$41  (1 unrouted)
N$42  (1 unrouted)
N$43  (1 unrouted)
N$44  (1 unrouted)
N$45  (1 unrouted)
N$46  (1 unrouted)
N$47  (1 unrouted)
N$48  (1 unrouted)
N$49  (1 unrouted)
N$50  (1 unrouted)
N$51  (1 unrouted)
N$52  (1 unrouted)
N$61  (2 unrouted)
N$62  (2 unrouted)
N$63  (3 unrouted)
N$66  (1 unrouted)
OUTX  (1 unrouted)
OUTY  (1 unrouted)
R1+  (2 unrouted)
R+  (1 unrouted)
SCL  (3 unrouted)
SDA  (3 unrouted)
SHUTTER  (1 unrouted)
T26  (2 unrouted)
T27  (2 unrouted)
T38  (2 unrouted)
TB  (2 unrouted)
TG  (2 unrouted)
TR  (2 unrouted)
X1+  (2 unrouted)
X1-  (2 unrouted)
X2  (4 unrouted)
X+  (1 unrouted)
X-  (1 unrouted)
X_IN  (3 unrouted)
Y1+  (2 unrouted)
Y1-  (2 unrouted)
Y2  (4 unrouted)
Y+  (1 unrouted)
Y-  (1 unrouted)
Y_IN  (3 unrouted)

### Text on the board
tNames: -12V
bNames: -12V
TallParts: ISP
ArduinoHoles: 3.2mm | 2.2mm | 3.2mm